# Altium schematic sheet Power_Drive.SchDoc: Power Drive
size A3; Author: Eladio Delgado Mingorance; CompanyName: bq - Mundo Reader; Organization: bq - Mundo Reader; Revision: 1.4; SheetNumber: 4; SheetTotal: 10
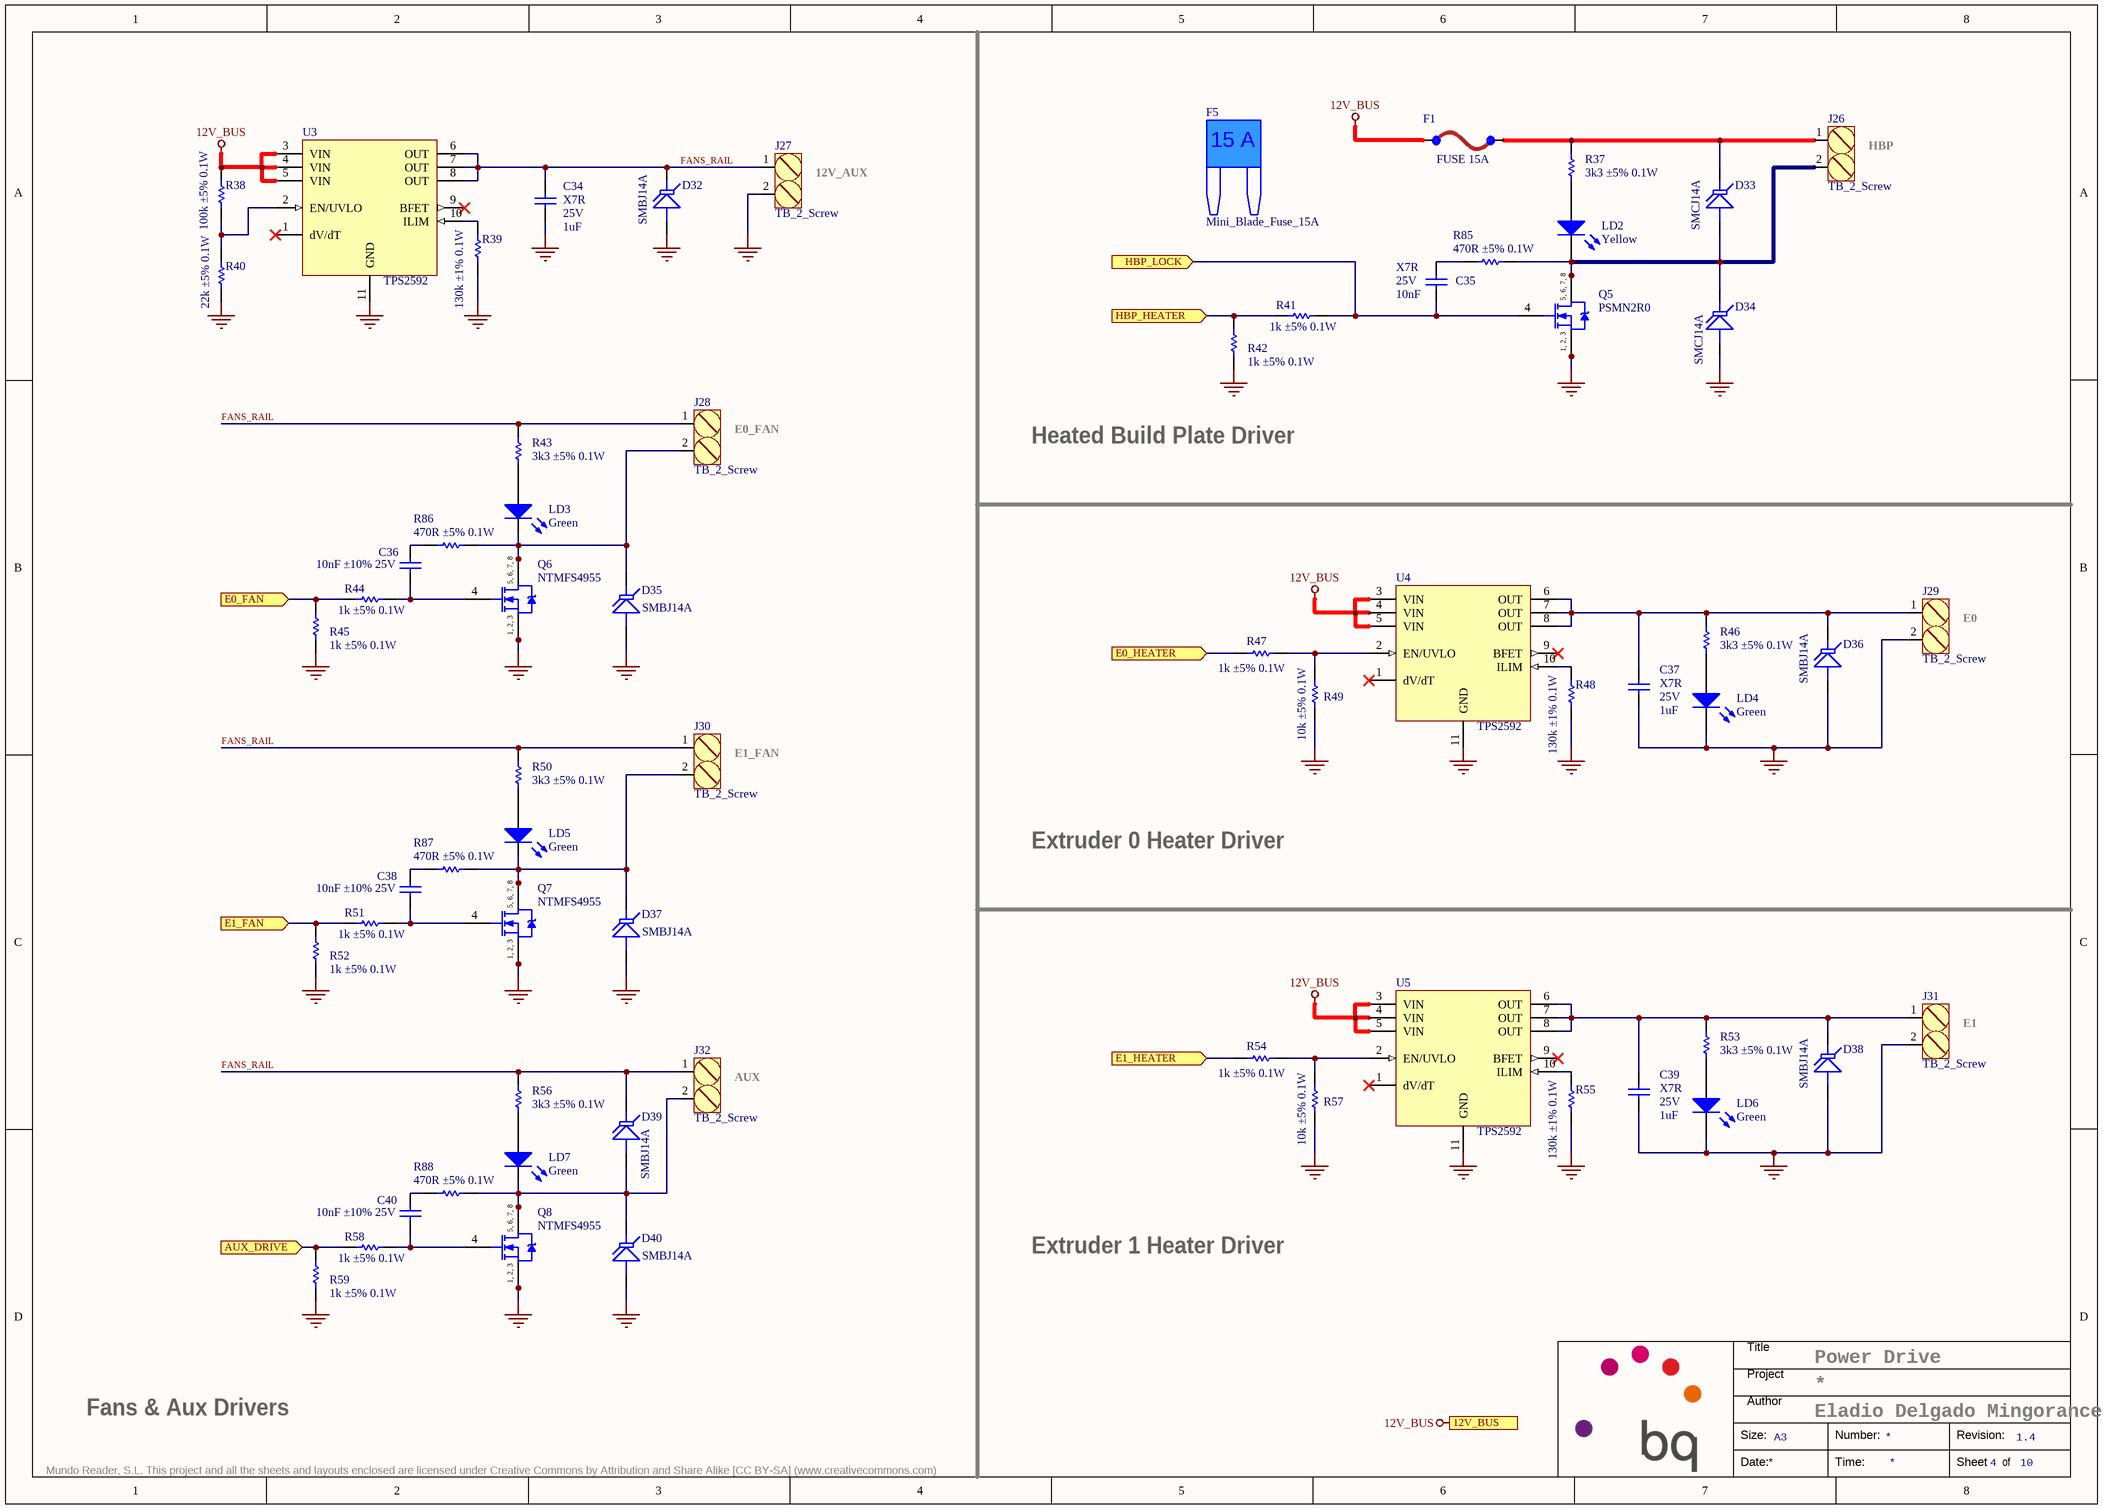
[diagram p0: Power_Drive.SchDoc]

## Parts
C34  Dielectric: X7R  Voltage: 25V  Capacitance: 1uF  [C0805]  (hidden comment: Capacitor)
C35  Dielectric: X7R  Voltage: 25V  Capacitance: 10nF  [C0603]  (hidden comment: Capacitor)
C36  value 10nF ±10% 25V  [C0603]  (hidden comment: Capacitor)
C37  Dielectric: X7R  Voltage: 25V  Capacitance: 1uF  [C0805]  (hidden comment: Capacitor)
C38  value 10nF ±10% 25V  [C0603]  (hidden comment: Capacitor)
C39  Dielectric: X7R  Voltage: 25V  Capacitance: 1uF  [C0805]  (hidden comment: Capacitor)
C40  Variants: 10nF ±10% 25V  [C0603]  (hidden comment: Capacitor)
D32  SMBJ14A  [DO-214AA]
D33  SMCJ14A  [DO-214AB-SMC]
D34  SMCJ14A  [DO-214AB-SMC]
D35  SMBJ14A  [DO-214AA]
D36  SMBJ14A  [DO-214AA]
D37  SMBJ14A  [DO-214AA]
D38  SMBJ14A  [DO-214AA]
D39  SMBJ14A  [DO-214AA]
D40  SMBJ14A  [DO-214AA]
F1  FUSE 15A  [Fuse_Holder_TH_3568]
F5  Mini_Blade_Fuse_15A  (mechanical)
J26  TB_2_Screw  [TB_5.00_2_Screw_15A]
J27  TB_2_Screw  [TB_5.00_2_Screw_15A]
J28  TB_2_Screw  [TB_5.00_2_Screw_15A]
J29  TB_2_Screw  [TB_5.00_2_Screw_15A]
J30  TB_2_Screw  [TB_5.00_2_Screw_15A]
J31  TB_2_Screw  [TB_5.00_2_Screw_15A]
J32  TB_2_Screw  [TB_5.00_2_Screw_15A]
LD2  Yellow  [LED0603]
LD3  Green  [LED0603]
LD4  Green  [LED0603]
LD5  Green  [LED0603]
LD6  Green  [LED0603]
LD7  Green  [LED0603]
Q5  PSMN2R0  [NXP_LFPAK56]
Q6  NTMFS4955  [OS_DFN5]
Q7  NTMFS4955  [OS_DFN5]
Q8  NTMFS4955  [OS_DFN5]
R37  value 3k3 ±5% 0.1W  [R0603]  (hidden comment: Resistor)
R38  value 100k ±5% 0.1W  [R0603]  (hidden comment: Resistor)
R39  value 130k ±1% 0.1W  [R0603]  (hidden comment: Resistor)
R40  value 22k ±5% 0.1W  [R0603]  (hidden comment: Resistor)
R41  value 1k ±5% 0.1W  [R0603]  (hidden comment: Resistor)
R42  value 1k ±5% 0.1W  [R0603]  (hidden comment: Resistor)
R43  value 3k3 ±5% 0.1W  [R0603]  (hidden comment: Resistor)
R44  value 1k ±5% 0.1W  [R0603]  (hidden comment: Resistor)
R45  value 1k ±5% 0.1W  [R0603]  (hidden comment: Resistor)
R46  value 3k3 ±5% 0.1W  [R0603]  (hidden comment: Resistor)
R47  value 1k ±5% 0.1W  [R0603]  (hidden comment: Resistor)
R48  value 130k ±1% 0.1W  [R0603]  (hidden comment: Resistor)
R49  value 10k ±5% 0.1W  [R0603]  (hidden comment: Resistor)
R50  value 3k3 ±5% 0.1W  [R0603]  (hidden comment: Resistor)
R51  value 1k ±5% 0.1W  [R0603]  (hidden comment: Resistor)
R52  value 1k ±5% 0.1W  [R0603]  (hidden comment: Resistor)
R53  value 3k3 ±5% 0.1W  [R0603]  (hidden comment: Resistor)
R54  value 1k ±5% 0.1W  [R0603]  (hidden comment: Resistor)
R55  value 130k ±1% 0.1W  [R0603]  (hidden comment: Resistor)
R56  value 3k3 ±5% 0.1W  [R0603]  (hidden comment: Resistor)
R57  value 10k ±5% 0.1W  [R0603]  (hidden comment: Resistor)
R58  value 1k ±5% 0.1W  [R0603]  (hidden comment: Resistor)
R59  value 1k ±5% 0.1W  [R0603]  (hidden comment: Resistor)
R85  value 470R ±5% 0.1W  [R0603]  (hidden comment: Resistor)
R86  value 470R ±5% 0.1W  [R0603]  (hidden comment: Resistor)
R87  value 470R ±5% 0.1W  [R0603]  (hidden comment: Resistor)
R88  value 470R ±5% 0.1W  [R0603]  (hidden comment: Resistor)
U3  TPS2592  [S-PVSON-N10]
U4  TPS2592  [S-PVSON-N10]
U5  TPS2592  [S-PVSON-N10]

## Ports
12V_BUS, AUX_DRIVE (in), E0_FAN (in), E0_HEATER (in), E1_FAN (in), E1_HEATER (in), HBP_HEATER (in), HBP_LOCK (in)

## Nets
12V_BUS: F1.1 R38.1 U3.3(VIN) U3.4(VIN) U3.5(VIN) U4.3(VIN) U4.4(VIN) U4.5(VIN) U5.3(VIN) U5.4(VIN) U5.5(VIN) ; port 12V_BUS
GND: C34.1 C37.1 C39.1 D32.A D34.A D35.A D36.A D37.A D38.A D40.A J27.2 J29.2 J31.2 LD4.K LD6.K Q5.1(S) Q5.2(S) Q5.3(S) Q6.1(S) Q6.2(S) Q6.3(S) Q7.1(S) Q7.2(S) Q7.3(S) Q8.1(S) Q8.2(S) Q8.3(S) R39.1 R40.1 R42.1 R45.1 R48.1 R49.1 R52.1 R55.1 R57.1 R59.1 U3.11(GND) U4.11(GND) U5.11(GND)
AUX_DRIVE: R58.1 R59.2 ; port AUX_DRIVE
E0_FAN: R44.1 R45.2 ; port E0_FAN
E0_HEATER: R47.1 ; port E0_HEATER
E1_FAN: R51.1 R52.2 ; port E1_FAN
E1_HEATER: R54.1 ; port E1_HEATER
FANS_RAIL: C34.2 D32.K D39.K J27.1 J28.1 J30.1 J32.1 R43.2 R50.2 R56.2 U3.6(OUT) U3.7(OUT) U3.8(OUT)
HBP_HEATER: R41.1 R42.2 ; port HBP_HEATER
HBP_LOCK: C35.1 Q5.4(G) R41.2 ; port HBP_LOCK
NetC35_2: C35.2 R85.1
NetC36_1: C36.1 Q6.4(G) R44.2
NetC36_2: C36.2 R86.1
NetC37_2: C37.2 D36.K J29.1 R46.2 U4.6(OUT) U4.7(OUT) U4.8(OUT)
NetC38_1: C38.1 Q7.4(G) R51.2
NetC38_2: C38.2 R87.1
NetC39_2: C39.2 D38.K J31.1 R53.2 U5.6(OUT) U5.7(OUT) U5.8(OUT)
NetC40_1: C40.1 Q8.4(G) R58.2
NetC40_2: C40.2 R88.1
NetD33_A: D33.A D34.K J26.2 LD2.K Q5.5(D) Q5.6(D) Q5.7(D) Q5.8(D) R85.2
NetD33_K: D33.K F1.2 J26.1 R37.2
NetD35_K: D35.K J28.2 LD3.K Q6.5(D) Q6.6(D) Q6.7(D) Q6.8(D) R86.2
NetD37_K: D37.K J30.2 LD5.K Q7.5(D) Q7.6(D) Q7.7(D) Q7.8(D) R87.2
NetD39_A: D39.A D40.K J32.2 LD7.K Q8.5(D) Q8.6(D) Q8.7(D) Q8.8(D) R88.2
NetLD2_A: LD2.A R37.1
NetLD3_A: LD3.A R43.1
NetLD4_A: LD4.A R46.1
NetLD5_A: LD5.A R50.1
NetLD6_A: LD6.A R53.1
NetLD7_A: LD7.A R56.1
NetR38_2: R38.2 R40.2 U3.2(EN/UVLO)
NetR39_2: R39.2 U3.10(ILIM)
NetR47_2: R47.2 R49.2 U4.2(EN/UVLO)
NetR48_2: R48.2 U4.10(ILIM)
NetR54_2: R54.2 R57.2 U5.2(EN/UVLO)
NetR55_2: R55.2 U5.10(ILIM)

Not connected (* = marked no-connect by the designer): U3 1(dV/dT)* 9(BFET)*; U4 1(dV/dT)* 9(BFET)*; U5 1(dV/dT)* 9(BFET)*

## Notes on the sheet
- (near J27) 12V_AUX
- (near J26) HBP
- (near J28) E0_FAN
- Heated Build Plate Driver
- (near J29) E0
- (near J30) E1_FAN
- Extruder 0 Heater Driver
- (near J31) E1
- (near J32) AUX
- Extruder 1 Heater Driver
- Fans & Aux Drivers
- Title
- Project
- Size:
- Author
- A3
- Number:
- Revision:
- Mundo Reader, S.L. This project and all the sheets and layouts enclosed are licensed under Creative Commons by Attribution and Share Alike [CC BY-SA] (www.creativecommons.com)
- Date:
- Time:
- Sheet
- of
- (in symbol Mini Blade Fuse 15A) 15 A
- (in symbol NTMFS4955) 5, 6, 7, 8; 1, 2, 3
- (in symbol PSMN2R0) 5, 6, 7, 8; 1, 2, 3

## Library data of the parts
C34 C37 C39 = C0805_1uF_25V_X7R: Manufacturer: TDK; Value: 1uF ±10% 25V; Tolerance: ±10%; OrderingCode: C2012X7R1E105K125AB; Temp_ Max: 125; Temp_ Min: -55; Part Number: C0805_1uF_25V_X7R; Price (€): 0,024
C35 = C0603_10nF_25V_±10%: Manufacturer: Kemet; Value: 10nF ±10% 25V; Tolerance: ±10%; OrderingCode: C0603C103K3RAC; Temp_ Max: 125; Temp_ Min: -55; Part Number: C0603_10nF_25V_±10%; Price (€): 0,035
C36 C38 = C0603_10nF_25V_±10%: Manufacturer: Kemet; Dielectric: X7R; Voltage: 25V; Capacitance: 10nF; Tolerance: ±10%; OrderingCode: C0603C103K3RAC; Temp_ Max: 125; Temp_ Min: -55; Variants: NL; Part Number: C0603_10nF_25V_±10%; Price (€): 0,035
C40 = C0603_10nF_25V_±10%: Manufacturer: Kemet; Value: 10nF ±10% 25V; Dielectric: X7R; Voltage: 25V; Capacitance: 10nF; Tolerance: ±10%; OrderingCode: C0603C103K3RAC; Temp_ Max: 125; Temp_ Min: -55; Part Number: C0603_10nF_25V_±10%; Price (€): 0,035
D32 D35-D40 = TVS 14V SMB: Transient Suppression Diodes; Manufacturer: Fairchild Semiconductor; Voltage: 14V; Breakdown Voltage: 15,6V; Overvoltage Current: 25,9A; Temp_ Max: 150; Temp_ Min: -55; Part Number: TVS 14V SMB; OrderingCode: SMBJ14A; Price (€): 0,082; Manufacturer 2: Littelfuse; OrderingCode 2: SMBJ14A
D33 D34 = TVS 14V SMC: Transient Suppression Diodes; Manufacturer: Fairchild Semiconductor; Voltage: 14V; Breakdown Voltage: 15,6V; Overvoltage Current: 64,7A; Temp_ Max: 150; Temp_ Min: -55; Part Number: TVS 14V SMC; OrderingCode: SMCJ14A; Price (€): 0,134; Manufacturer 2: Littelfuse; OrderingCode 2: SMCJ14A
F1 = Mini Fuse Holder Vert TH: Thermal fuse; Manufacturer: Keystone Electronics; Voltage: 500VAC; Current: 20A; OrderingCode: 3568; Temp_ Max: 145; Temp_ Min: -50; Part Number: Mini Fuse Holder Vert TH; Price (€): 0,479
F5 = Mini Blade Fuse 15A: Protection, Mini Blade Fuse 15A; Manufacturer: Littelfuse; Voltage: 32; Current: 15; OrderingCode: 0297015.U; Temp_ Max: 125; Temp_ Min: -40; Part Number: Mini Blade Fuse 15A; Price (€): 0,126
J26-J32 = TB_5.00_2_Screw_15A: Terminal Block Fixed with Screw; Manufacturer: TE Connectivity; OrderingCode: 796682-2; Temp_Max: 105; Temp_Min: -40; OrderingCode 2: 796681-2; Value: 2; Part Number: TB_5.00_2_Screw_15A; Price (€): 0,441; Manufacturer 2: TE Connectivity
LD2 = HSMY-C190: Light Emitting Diode; Manufacturer: Avago Technologies; Temp_ Max: 85; Temp_ Min: -40; OrderingCode 2: LY Q971-H1L2-36; Part Number: HSMY-C190; OrderingCode: HSMY-C190; Price (€): 0,064; Manufacturer 2: OSRAM Opto; Value: Yellow
LD3-LD7 = HSMG-C190: Light Emitting Diode; Manufacturer: Avago Technologies; Temp_ Max: 85; Temp_ Min: -40; OrderingCode 2: LG Q971-KN-1; Part Number: HSMG-C190; OrderingCode: HSMG-C190; Price (€): 0,064; Manufacturer 2: OSRAM Opto; Value: Green
Q5 = PSMN2R0: Power SO8 N-MOSFET; Manufacturer: NXP; Vds: 30V; Vgss: 20V; Id: 100A; OrderingCode: PSMN2R0-30YL; Temp_ Max: 175; Temp_ Min: -55; Part Number: PSMN2R0; Price (€): 0,34
Q6-Q8 = NTMFS4955: Power SO8 N-MOSFET; Manufacturer: On Semiconductor; Vds: 30V; Vgss: 20V; Id: 48A; OrderingCode: NTMFS4955NT1G; Temp_ Max: 150; Temp_ Min: -55; Part Number: NTMFS4955; Price (€): 0,124
R37 R43 R46 R50 R53 R56 = R0603_3k3_0.1W_±5%: Manufacturer: Vishay; Tolerance: ±5%; OrderingCode: CRCW06033K30JN; Power: 0.1W; Resistance: 3k3; Temp_ Max: 155; Temp_ Min: -55; PackageDescription: SMD; Part Number: R0603_3k3_0.1W_±5%; Price (€): 0,003
R38 = R0603_100k_0.1W_±5%: Manufacturer: Vishay; Tolerance: ±5%; OrderingCode: CRCW0603100KJN; Power: 0.1W; Resistance: 100k; Temp_ Max: 155; Temp_ Min: -55; PackageDescription: SMD; Part Number: R0603_100k_0.1W_±5%; Price (€): 0,003
R39 R48 R55 = R0603_130k_0.1W_±1%: Manufacturer: Vishay; Tolerance: ±1%; OrderingCode: CRCW0603130KFK; Power: 0.1W; Resistance: 130k; Temp_ Max: 155; Temp_ Min: -55; PackageDescription: SMD; Part Number: R0603_130k_0.1W_±1%; Price (€): 0,014
R40 = R0603_22k_0.1W_±5%: Manufacturer: Vishay; Tolerance: ±5%; OrderingCode: CRCW060322K0JN; Power: 0.1W; Resistance: 22k; Temp_ Max: 155; Temp_ Min: -55; PackageDescription: SMD; Part Number: R0603_22k_0.1W_±5%; Price (€): 0,003
R41 R42 R44 R45 R47 R51 R52 R54 R58 R59 = R0603_1k_0.1W_±5%: Manufacturer: Vishay; Tolerance: ±5%; OrderingCode: CRCW06031K00JN; Power: 0.1W; Resistance: 1k; Temp_ Max: 155; Temp_ Min: -55; PackageDescription: SMD; Part Number: R0603_1k_0.1W_±5%; Price (€): 0,003
R49 R57 = R0603_10k_0.1W_±5%: Manufacturer: Vishay; Tolerance: ±5%; OrderingCode: CRCW060310K0JN; Power: 0.1W; Resistance: 10k; Temp_ Max: 155; Temp_ Min: -55; PackageDescription: SMD; Part Number: R0603_10k_0.1W_±5%; Price (€): 0,003
R85-R88 = R0603_470R_0.1W_±5%: Manufacturer: Vishay; Tolerance: ±5%; OrderingCode: CRCW0603470RJN; Power: 0.1W; Resistance: 470R; Temp_ Max: 155; Temp_ Min: -55; PackageDescription: SMD; Part Number: R0603_470R_0.1W_±5%; Price (€): 0,003
U3-U5 = TPS2592: 12V eFuse, 28 mR, 2 to 5A; Manufacturer: Texas Instruments; OrderingCode: TPS2592ZA; Temp_ Max: 125; Temp_ Min: -40; OrderingCode 2: TPS2592AA; Part Number: TPS2592; Price (€): 0,734; Manufacturer 2: Texas Instruments